# Altium schematic sheet Bramka_Main.SchDoc
size A4; SheetNumber: 1; SheetTotal: 8
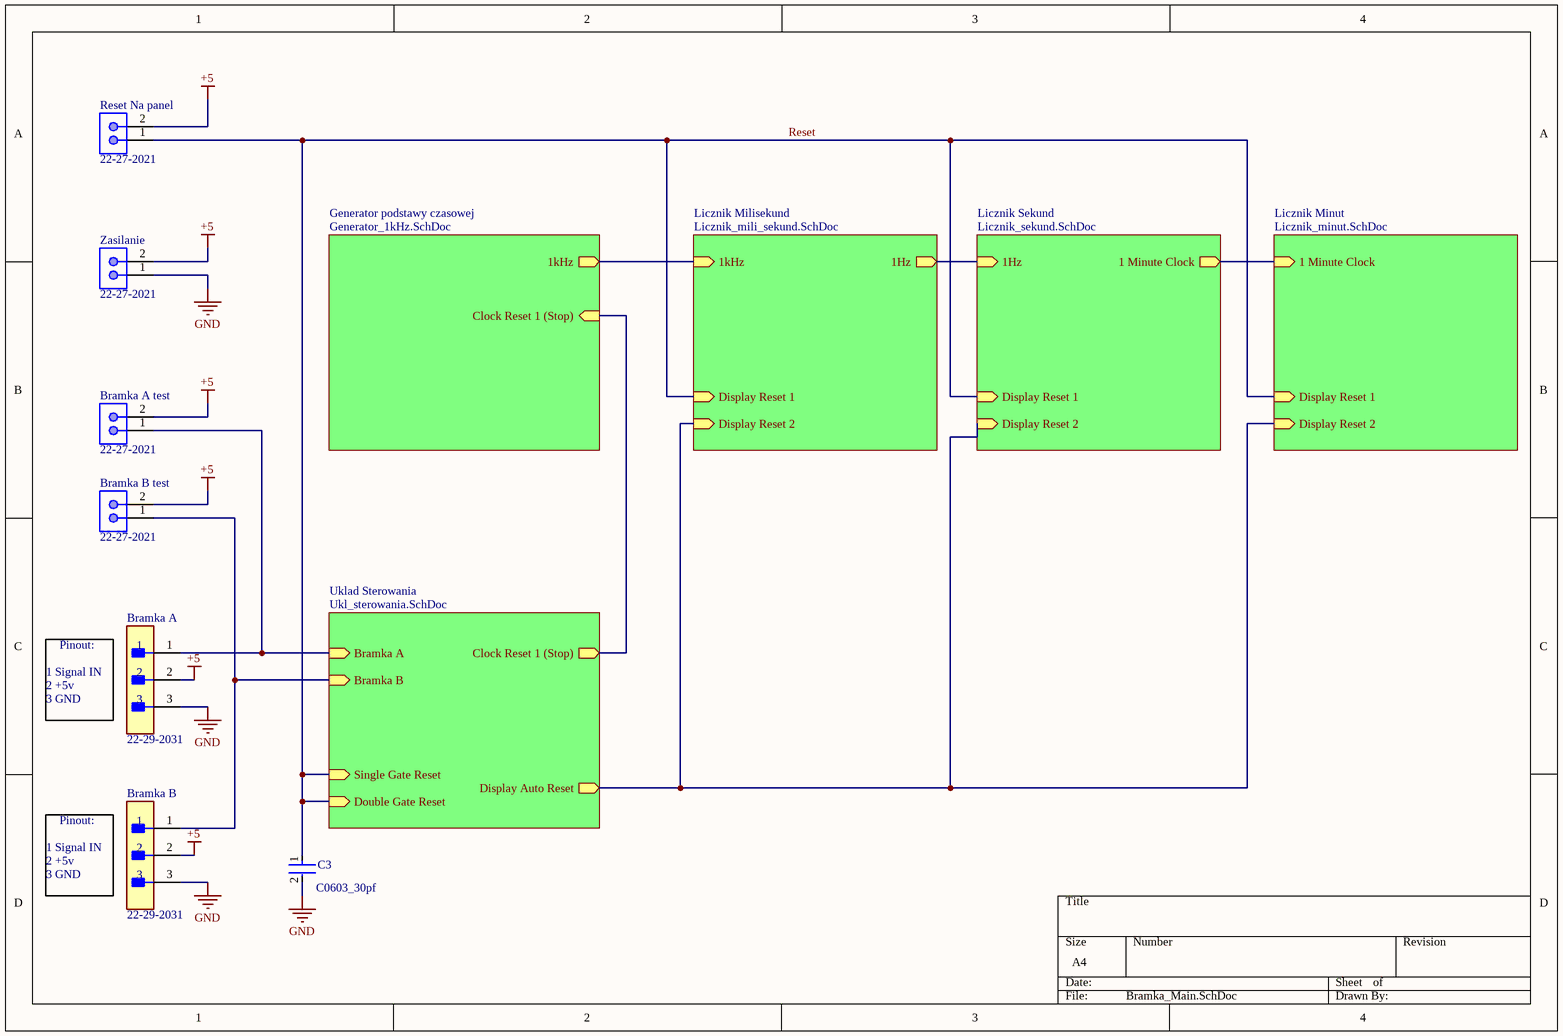
[diagram p0: Bramka_Main.SchDoc]

## Parts
Bramka_A  22-29-2031  [FP-22-29-2031-MFG]
Bramka_A_test  22-27-2021  [MOLX-22-27-2021_V]
Bramka_B  22-29-2031  [FP-22-29-2031-MFG]
Bramka_B_test  22-27-2021  [MOLX-22-27-2021_V]
C3  C0603_30pf  [FP-C0603C-CF-MFG]
Reset_Na_panel  22-27-2021  [MOLX-22-27-2021_V]
Zasilanie  22-27-2021  [MOLX-22-27-2021_V]

## Sub-sheets
Generator podstawy czasowej = Generator_1kHz.SchDoc: Clock Reset 1 (Stop) (in), 1kHz (out)
Licznik Milisekund = Licznik_mili_sekund.SchDoc: 1kHz (in), 1Hz (out), Display Reset 1 (in), Display Reset 2 (in)
Licznik Minut = Licznik_minut.SchDoc: 1 Minute Clock (in), Display Reset 1 (in), Display Reset 2 (in)
Licznik Sekund = Licznik_sekund.SchDoc: 1 Minute Clock (out), 1Hz (in), Display Reset 1 (in), Display Reset 2 (in)
Uklad Sterowania = Ukl_sterowania.SchDoc: Bramka A (in), Bramka B (in), Clock Reset 1 (Stop) (out), Single Gate Reset (in), Double Gate Reset (in), Display Auto Reset (out)

## Nets
+5: Bramka_A.2 Bramka_A_test.2 Bramka_B.2 Bramka_B_test.2 Reset_Na_panel.2 Zasilanie.2
GND: Bramka_A.3 Bramka_B.3 C3.2 Zasilanie.1
Reset: C3.1 Reset_Na_panel.1 ; sheet Licznik Milisekund/Display Reset 1, sheet Licznik Sekund/Display Reset 1, sheet Licznik Minut/Display Reset 1, sheet Uklad Sterowania/Single Gate Reset, sheet Uklad Sterowania/Double Gate Reset
NetBramka_A_1: Bramka_A.1 Bramka_A_test.1 ; sheet Uklad Sterowania/Bramka A
NetBramka_B_1: Bramka_B.1 Bramka_B_test.1 ; sheet Uklad Sterowania/Bramka B
(unnamed): sheet Generator podstawy czasowej/Clock Reset 1 (Stop), sheet Uklad Sterowania/Clock Reset 1 (Stop)
(unnamed): sheet Generator podstawy czasowej/1kHz, sheet Licznik Milisekund/1kHz
(unnamed): sheet Licznik Milisekund/1Hz, sheet Licznik Sekund/1Hz
(unnamed): sheet Licznik Milisekund/Display Reset 2, sheet Licznik Sekund/Display Reset 2, sheet Licznik Minut/Display Reset 2, sheet Uklad Sterowania/Display Auto Reset
(unnamed): sheet Licznik Sekund/1 Minute Clock, sheet Licznik Minut/1 Minute Clock

## Notes on the sheet
- (near Bramka_A) Pinout:
- (near Bramka_A) 1 Signal IN
- 2 +5v
- 3 GND
- (near Bramka_B) 1 Signal IN
- (near Bramka_B) Pinout:

## Library data of the parts
Bramka_A Bramka_B = CMP-04776-000327-1: CONN HEADER VERT 3POS 2.54MM; Contact Resistance: 10mR; Number of Positions: 3; Voltage Rating: 250V; Gender: Male; Connector Type: Male Pin; Current Rating: 4A; Packaging: Bulk; Housing Material: Nylon; Min Operating Temperature: 0°C; Color: Natural; RoHS Compliant: Yes; Housing Color: White; Number of Rows: 1; Pitch: 2.54mm; Mount: Through Hole; Fastening Type: Friction; Length: 7.62mm; Depth: 5.8mm; Contact Material: Brass; Max Operating Temperature: 75°C; Number of Contacts: 3; Contact Type: Male Pin; Working Voltage: 250V; Orientation: Straight; Lead Pitch: 2.54mm; Radiation Hardening: No; Termination: Solder; Contact Plating: Gold; Contact Mating Length: 0.295inch; Series: KK® 6410
Bramka_A_test Bramka_B_test Reset_Na_panel Zasilanie = CMP-2000-05537-1: Male Header, Pitch 2.54 mm, 1 x 2 Position, Height 11.7 mm, Tail Length 3.56 mm, 0 to 75 degC, RoHS, Bulk; Manufacturer: Molex; PartNumber: 0022272021; Current rating: 4A; Package Version: Rev. BC, 02/2012; Voltage rating: 250V; No. of Positions: 2; Pitch: 2.54mm; No. of Rows: 1; Orientation: Vertical; Operating temperature: 0°Cto+75°C; Manufacturer URL: http://www.molex.com/; Mounting Technology: ThroughHole; Housing material: Nylon(UL94V-0); Package Description: 2-Leads Header, Body 5.08 x 5.8 mm, Pitch 2.54 mm; Voltage - Max: 250V; Datasheet URL: http://www.molex.com/pdm_docs/sd/022272021_sd.pdf; Package Reference: 22-27-2021; Contact material: Tinplatedbrass; Current - Max: 4A; Datasheet Version: Rev. F, 06/2009
C3 = CMP-1035-00914-3: CAP CER 30PF 50V 5% NP0 0603; Manufacturer Part Number: C0603C300J5GACTU; Manufacturer: KEMET; Automotive Grade: Grade 1; Temperature Coefficient: 30ppm/°C; Material: Ceramic; Temperature Characteristic: C0G; Tolerance: 0.05; ComponentLink2URL: https://api.kemet.com/component-edge/download/datasheet/C0603C100J5GACAUTO.pdf; Automotive: Yes; Device Class L2: Capacitors; Device Class L1: Passive Components; Device Class L3: Ceramic Capacitors; RoHS: TRUE; Octopart: https://octopart.com/c0603c300j5gactu-kemet-199455; Lead Free: Yes; Value: 30 pF; Temperature Range High: +125°C; Category: Cap; Temperature: -55°C to +125°C; Package: C0603C-CF; Capacitance: 30 pF; Digikey Description: CAP CER 30PF 50V 5% NP0 0603; Height: 0.87mm; ComponentLink2Description: Datasheet; Temperature Range Low: -55°C; Mouser Description: Multilayer Ceramic Capacitors MLCC - SMD/SMT 50volts 30pF C0G 5%; Voltage Rating: 50 V